# Altium project EXB200803.PrjPcb
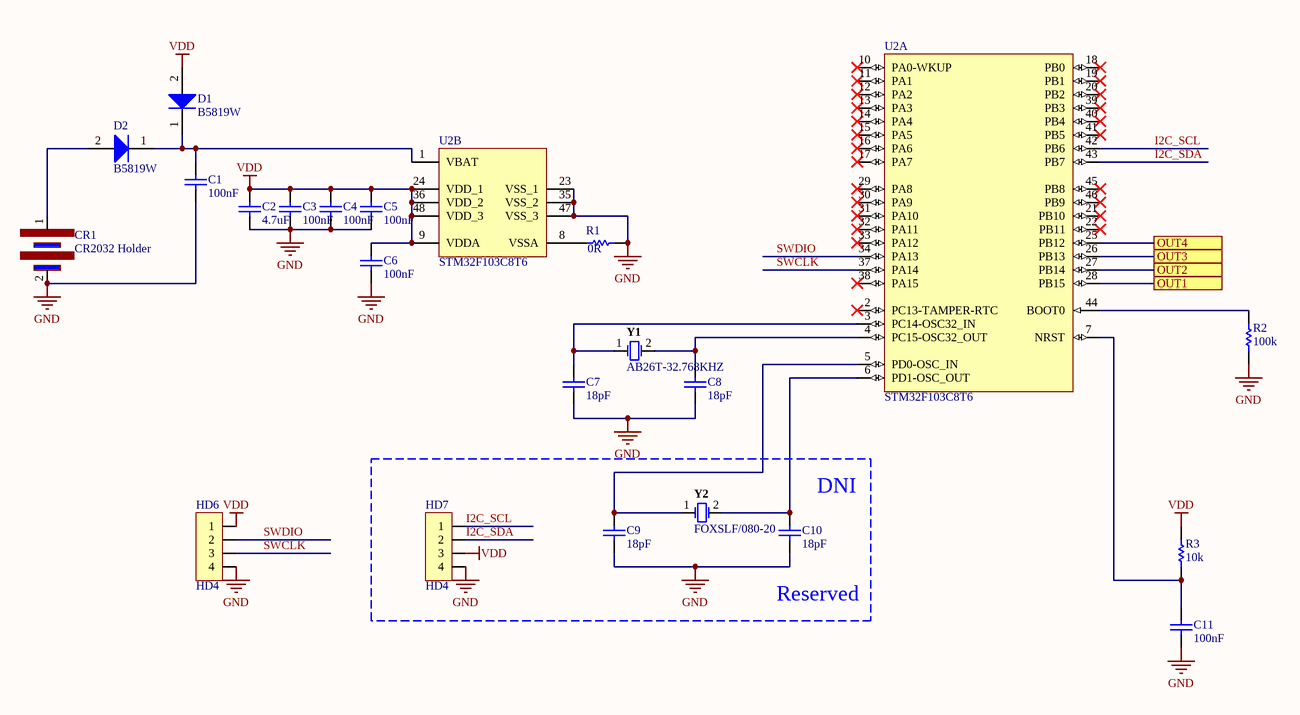
[diagram p0: 02. MCU.SchDoc]
4 sheets, 75 parts. Net scope: flat (ports and power ports of the same name join across sheets).
Board file: EXBELL200803.PcbDoc
Sheets:
  01. MAIN.SchDoc
  02. MCU.SchDoc
  03. OUTPUT.SchDoc
  04. POWER SUPPLY.SchDoc

## Sheet 01. MAIN.SchDoc
size A4; DocumentNumber: 1; SheetNumber: 1; SheetTotal: 4

### Notes on the sheet
- Title
- Size:
- Date:
- A4
- Number:
- Time:
- Revision:
- Sheet
- of
- N.S.T
- Design by:
- Check by:
- https://github.com/tung080827

## Sheet 02. MCU.SchDoc
size A4; DocumentNumber: 2; SheetNumber: 2; SheetTotal: 4

### Parts
C1  100nF  [0603 CAP]
C2  4.7uF  [0603 CAP]
C3  100nF  [0603 CAP]
C4  100nF  [0603 CAP]
C5  100nF  [0603 CAP]
C6  100nF  [0603 CAP]
C7  18pF  [0603 CAP]
C8  18pF  [0603 CAP]
C9  18pF  [0603 CAP]
C10  18pF  [0603 CAP]
C11  100nF  [0603 CAP]
CR1  CR2032 Holder  [CR2032]
D1  B5819W  [SOD123]
D2  B5819W  [SOD123]
HD6  HD4  [HD4x1 2.54mm]
HD7  HD4  [HD4x1 2.54mm]
R1  0R  [0603 RES]
R2  100k  [0603 RES]
R3  10k  [0603 RES]
U2  STM32F103C8T6  [STM-LQFP48]  (parts A,B of 2)
Y1  AB26T-32.768KHZ  [Crystal 3x8]
Y2  FOXSLF/080-20  [CRYSTAL HC49]

### Ports
OUT1, OUT2, OUT3, OUT4

### Nets
GND: C1.1 C2.1 C3.1 C4.1 C5.1 C6.1 C7.1 C8.1 C9.1 C10.1 C11.1 CR1.2(VSS) HD6.4 HD7.4 R1.2 R2.1 U2.23(VSS_1) U2.35(VSS_2) U2.47(VSS_3)
VDD: C2.2 C3.2 C4.2 C5.2 C6.2 D1.2(A) HD6.1 HD7.3 R3.2 U2.9(VDDA) U2.24(VDD_1) U2.36(VDD_2) U2.48(VDD_3)
I2C_SCL: HD7.1 U2.42(PB6)
I2C_SDA: HD7.2 U2.43(PB7)
SWCLK: HD6.3 U2.37(PA14)
SWDIO: HD6.2 U2.34(PA13)
NetC1_2: C1.2 D1.1(K) D2.1(K) U2.1(VBAT)
NetC7_2: C7.2 U2.3(PC14-OSC32_IN) Y1.1
NetC8_2: C8.2 U2.4(PC15-OSC32_OUT) Y1.2
NetC9_2: C9.2 U2.5(PD0-OSC_IN) Y2.1
NetC10_2: C10.2 U2.6(PD1-OSC_OUT) Y2.2
NetC11_2: C11.2 R3.1 U2.7(NRST)
NetCR1_1: CR1.1(VBAT) D2.2(A)
NetD7_1: U2.28(PB15) ; port OUT1
NetD8_1: U2.27(PB14) ; port OUT2
NetD9_1: U2.26(PB13) ; port OUT3
NetD10_1: U2.25(PB12) ; port OUT4
NetR1_1: R1.1 U2.8(VSSA)
NetR2_2: R2.2 U2.44(BOOT0)

Not connected (* = marked no-connect by the designer): U2 2(PC13-TAMPER-RTC)* 10(PA0-WKUP)* 11(PA1)* 12(PA2)* 13(PA3)* 14(PA4)* 15(PA5)* 16(PA6)* 17(PA7)* 18(PB0)* 19(PB1)* 20(PB2)* 21(PB10)* 22(PB11)* 29(PA8)* 30(PA9)* 31(PA10)* 32(PA11)* 33(PA12)* 38(PA15)* 39(PB3)* 40(PB4)* 41(PB5)* 45(PB8)* 46(PB9)*

### Notes on the sheet
- (near C10) DNI
- (near C10) Reserved
- Title
- Size:
- Date:
- A4
- Number:
- Time:
- Revision:
- Sheet
- of
- N.S.T
- Design by:
- Check by:
- https://github.com/tung080827

### Library data of the parts
C1 C3-C6 C11 = CMP-2100-03643-1: Chip Capacitor, 0.1 uF, +/- 10%, 50 V, -55 to 125 degC, 0603 (1608 Metric), RoHS, Tape and Reel; Manufacturer: Murata; Dielectric Material: Ceramic; Voltage Rating: 50V; Dielectric: X7R; Insulation Resistance: 10GR; Case Code (Metric): 1608; Lead Free: LeadFree; Depth: 0.8mm; Number of Pins: 2; Radiation Hardening: No; Case/Package: 0603; Manufacturer URL: http://www.murata.com/; Packaging: TapeandReel; Length: 1.6mm; Contact Plating: Tin; Datasheet URL: http://psearch.en.murata.com/capacitor/product/GRM188R71H104KA93%23.pdf; Tolerance: 10%; Case Code (Imperial): 0603; Min Operating Temperature: -55degC; RoHSCompliant: true; Capacitance: 100nF; Voltage: 50V; Termination: SMD/SMT; Mount: SurfaceMount; Material: Ceramic; Package Quantity: 1; Height: 0.8mm; Thickness: 0.035inch; REACH SVHC: NoSVHC; Max Operating Temperature: 125degC; Width: 0.8mm; Package Reference: 0603; Voltage Rating (DC): 50V; Datasheet Version: 42675.0; Package Description: 2-Pin Surface Mount Device, Body 1.6 x 0.8 mm
C2 = CMP-2100-03643-1: Chip Capacitor, 0.1 uF, +/- 10%, 50 V, -55 to 125 degC, 0603 (1608 Metric), RoHS, Tape and Reel; Manufacturer: Murata; Dielectric Material: Ceramic; Voltage Rating: 50V; Capacitance: 100nF; Dielectric: X7R; Insulation Resistance: 10GR; Case Code (Metric): 1608; Lead Free: LeadFree; Depth: 0.8mm; Number of Pins: 2; Radiation Hardening: No; Case/Package: 0603; Manufacturer URL: http://www.murata.com/; Packaging: TapeandReel; Length: 1.6mm; Contact Plating: Tin; Datasheet URL: http://psearch.en.murata.com/capacitor/product/GRM188R71H104KA93%23.pdf; Tolerance: 10%; Case Code (Imperial): 0603; Min Operating Temperature: -55degC; RoHSCompliant: true; Voltage: 50V; Termination: SMD/SMT; Mount: SurfaceMount; Material: Ceramic; Package Quantity: 1; Height: 0.8mm; Thickness: 0.035inch; REACH SVHC: NoSVHC; Max Operating Temperature: 125degC; Width: 0.8mm; Package Reference: 0603; Voltage Rating (DC): 50V; Datasheet Version: 42675.0; Package Description: 2-Pin Surface Mount Device, Body 1.6 x 0.8 mm
C7-C10 = CMP-2000-06099-1: Chip Capacitor, 18 pF, +/- 5%, 50 V, -55 to 125 degC, 0603 (1608 Metric), RoHS, Tape and Reel; Manufacturer: Samsung Electro-Mechanics; Rated Voltage: 50V; Dielectric: C0G; Manufacturer URL: http://www.samsungsem.com/global/index.jsp; Tolerance (%): ±5%; Package Description: 2-Pin Surface Mount Device, Body 1.60 x 0.80 mm; Datasheet URL: http://www.samsungsem.com/kr/support/product-search/mlcc/__icsFiles/afieldfile/2016/08/18/S_CL10C180JB8NNNC.pdf; Package Reference: 0603; Datasheet Version: 06/2016; Capacitance: 18pF; Mounting Technology: SurfaceMount; Case Size/Dimension: 0603
CR1 = CR2032
D1 D2 = CMP-1054-00068-1: Switching Diode, 2-Pin SOD-323, Pb-Free, Tape and Reel; Manufacturer: On Semiconductor; PartNumber: BAS16HT1G; Configuration: Single; IF Max (A): 0.2; trr Max (ns): 6; Packing: Tape and Reel; ComponentLink2URL: http://www.onsemi.com/pub_link/Collateral/BAS16HT1-D.PDF; ComponentLink3Description: Package Specification; RoHS: TRUE; PackageDescription: 2-Pin SOD, Body 1.7 x 1.25 mm; PackageReference: SOD-323-2-477-02; ComponentLink1URL: http://www.onsemi.com/; Mounting Technology: Surface Mount; ComponentLink1Description: Manufacturer URL; ComponentLink2Description: Datasheet; DatasheetVersion: Rev. 11; PackageVersion: Rev. H, 03/2007; ComponentLink3URL: http://www.onsemi.com/pub_link/Collateral/477-02.PDF.1
HD6 HD7 = HD4x1
R1-R3 = CMP-2000-03818-1: Manufacturer: Vishay Dale; Part Number: CRCW06030000Z0EB
U2 = CMP-0237-00215-3: ARM Cortex-M3 32-bit MCU, 64 KB Flash, 20 KB Internal RAM, 37 I/Os, 48-pin LQFP, -40 to 85 degC, Tray; Supply Voltage(Vcc) min (V): 2; Internal RAM Size (kB): 20; FLASH Size (Prog) (kB): 64; A/D Converter: 2x12-bit (10 Channel); I/Os (High Current): 37; Operating Frequency(F) (Processor speed) (MHz): 72; Core: ARM Cortex-M3; ComponentLink3Description: Package Specification; Mounting Technology: Surface Mount; PartNumber: STM32F103C8T6; PackageReference: LQFP48; Packing: Tray; ComponentLink3URL: http://www.st.com/st-web-ui/static/active/en/resource/technical/document/datasheet/DM00058181.pdf; DatasheetVersion: Rev. 16; ComponentLink1URL: http://www.st.com/web/en/home.html; PackageVersion: Rev. 6, 06/2013; ComponentLink2URL: http://www.st.com/st-web-ui/static/active/en/resource/technical/document/datasheet/CD00161566.pdf; ComponentLink1Description: Manufacturer URL; ComponentLink2Description: Datasheet; PackageDescription: 48-Pin Low Profile Quad Flat Package, 7 x 7 mm Body, 0.5 mm Pitch
Y1 = CMP-2000-05723-1: Crystal, 12.5 pF, 32.768 KHz, -10 to 60 degC, 2-Pin THD, RoHS, Bulk; Manufacturer: ABRACON; ESR: 35kOhms; Frequency Stability: -0.034PPM; Load Capacitance: 12.5pF; Tolerance: 20PPM; Case Length: 6.2mm; Case Diameter: 2.1mm; RoHS: Details; Product Category: Crystals; Type: WatchCrystal; Manufacturer URL: http://www.abracon.com/; Operating Temperature Range: -10Cto+60C; Package Description: 2-Pin Through Hole Device, Dia 2.1 mm, Body Length 6.2 mm; Termination Style: Radial; Datasheet Version: 06/2010; Datasheet URL: http://www.abracon.com/Resonators/AB26T.pdf; Packaging: Bulk; Factory Pack Quantity: 500; Brand: ABRACON; Mounting Technology: ThroughHole; Package URL: http://www.abracon.com/Support/PackageDrawing/Resonators/AB26T.PDF; Package / Case: Cylinder; Lead Spacing: 0.8mm; Dimensions: 2.1mmDia.x6.2mmL; Mounting Style: ThroughHole; Frequency: 32.768kHz; Package Reference: AB26T; Series: AB26T
Y2 = CMP-1749-00002-1: Resistance Weld Thru-Hole Crystal, 8 MHz, -20 to 70 degC, 2-Pin THD, RoHS, Bulk; Dropout Voltage: 2 V; Outputs: 1; Nominal Output Voltage: 5 V; Min Input Voltage: 7 V; Case\Package: TO-263-3; Max Input Voltage: 35 V; Max Ouput Current: 1 A; Length: 10.24 mm; Max Operating Temperature: 125 degC; Mount: Surface Mount; PackageDescription: 2-Pin Through Hole Device, Body 11.35 x 4.65 mm; Package Quantity: 50; Pins: 3; ComponentLink2URL: http://download.siliconexpert.com/pdfs/2015/4/5/6/5/7/200/fox_/manual/35607121449963728hc49slf.pdf; PackageReference: FOXSLF080-20; Min Operating Temperature: 0 degC; Height: 30.02 mm; Packaging: Rail/Tube; Radiation Hardening: No; Width: 9.35 mm; ComponentLink1URL: http://www.foxonline.com/; DatasheetVersion: Mar-15; ComponentLink1Description: Manufacturer URL; Output Voltage: 5 V; RoHSCompliant: true; REACH SVHC: No SVHC; Output Current: 1 A; ComponentLink2Description: Datasheet

## Sheet 03. OUTPUT.SchDoc
size A3; DocumentNumber: 4; SheetNumber: 4; SheetTotal: 4
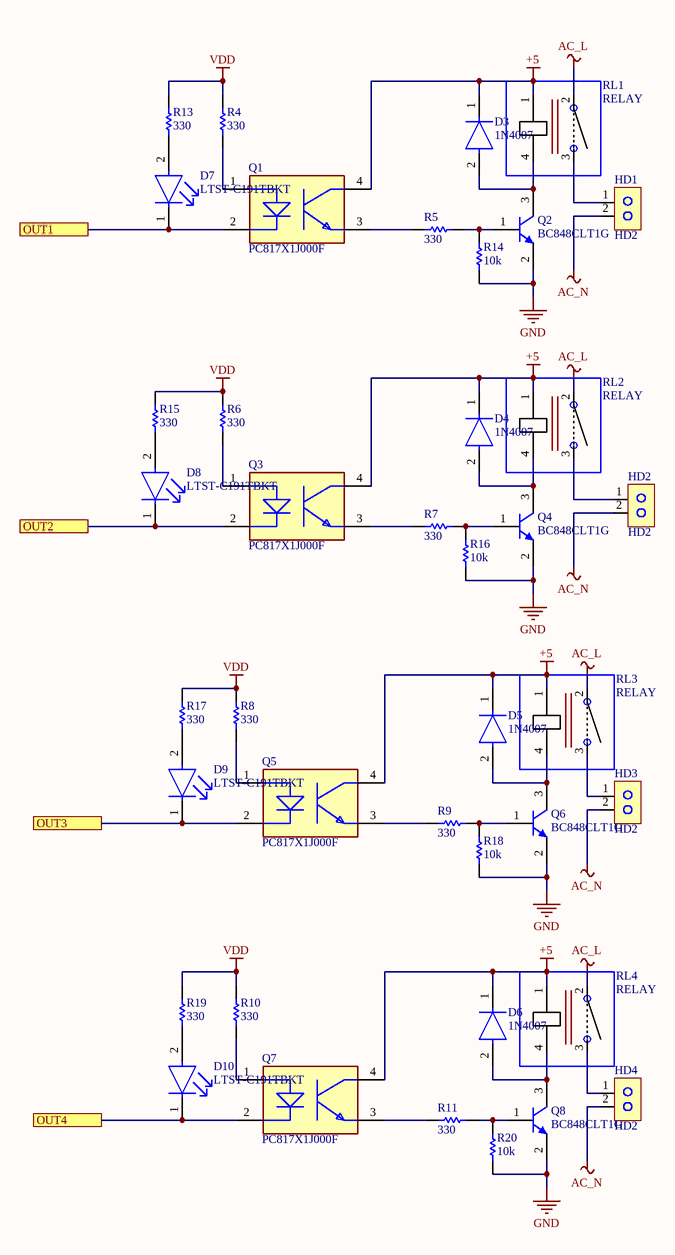
[diagram p1: 03. OUTPUT.SchDoc]

### Parts
D3  1N4007  [FP-SMA-MFG]
D4  1N4007  [FP-SMA-MFG]
D5  1N4007  [FP-SMA-MFG]
D6  1N4007  [FP-SMA-MFG]
D7  LTST-C191TBKT  [FP-LTST-C191TBKT-MFG]
D8  LTST-C191TBKT  [FP-LTST-C191TBKT-MFG]
D9  LTST-C191TBKT  [FP-LTST-C191TBKT-MFG]
D10  LTST-C191TBKT  [FP-LTST-C191TBKT-MFG]
HD1  HD2  [HD2 5.08mm]
HD2  HD2  [HD2 5.08mm]
HD3  HD2  [HD2 5.08mm]
HD4  HD2  [HD2 5.08mm]
Q1  PC817X1J000F  [FP-PC817X1J000F-MFG]
Q2  BC848CLT1G  [SOT23-3]
Q3  PC817X1J000F  [FP-PC817X1J000F-MFG]
Q4  BC848CLT1G  [SOT23-3]
Q5  PC817X1J000F  [FP-PC817X1J000F-MFG]
Q6  BC848CLT1G  [SOT23-3]
Q7  PC817X1J000F  [FP-PC817X1J000F-MFG]
Q8  BC848CLT1G  [SOT23-3]
R4  330  [0603 RES]
R5  330  [0603 RES]
R6  330  [0603 RES]
R7  330  [0603 RES]
R8  330  [0603 RES]
R9  330  [0603 RES]
R10  330  [0603 RES]
R11  330  [0603 RES]
R13  330  [0603 RES]
R14  10k  [0603 RES]
R15  330  [0603 RES]
R16  10k  [0603 RES]
R17  330  [0603 RES]
R18  10k  [0603 RES]
R19  330  [0603 RES]
R20  10k  [0603 RES]
RL1  RELAY  [RELAY G5NB OMRON]
RL2  RELAY  [RELAY G5NB OMRON]
RL3  RELAY  [RELAY G5NB OMRON]
RL4  RELAY  [RELAY G5NB OMRON]

### Ports
OUT1, OUT2, OUT3, OUT4

### Nets
+5: D3.1(C) D4.1(C) D5.1(C) D6.1(C) Q1.4(C) Q3.4(C) Q5.4(C) Q7.4(C) RL1.1 RL2.1 RL3.1 RL4.1
AC_L: RL1.2 RL2.2 RL3.2 RL4.2
AC_N: HD1.2 HD2.2 HD3.2 HD4.2
GND: Q2.2(E) Q4.2(E) Q6.2(E) Q8.2(E) R14.2 R16.2 R18.2 R20.2
VDD: R4.1 R6.1 R8.1 R10.1 R13.1 R15.1 R17.1 R19.1
NetD3_2: D3.2(A) Q2.3(C) RL1.4
NetD4_2: D4.2(A) Q4.3(C) RL2.4
NetD5_2: D5.2(A) Q6.3(C) RL3.4
NetD6_2: D6.2(A) Q8.3(C) RL4.4
NetD7_1: D7.1(C) Q1.2(C) ; port OUT1
NetD7_2: D7.2(A) R13.2
NetD8_1: D8.1(C) Q3.2(C) ; port OUT2
NetD8_2: D8.2(A) R15.2
NetD9_1: D9.1(C) Q5.2(C) ; port OUT3
NetD9_2: D9.2(A) R17.2
NetD10_1: D10.1(C) Q7.2(C) ; port OUT4
NetD10_2: D10.2(A) R19.2
NetHD1_1: HD1.1 RL1.3
NetHD2_1: HD2.1 RL2.3
NetHD3_1: HD3.1 RL3.3
NetHD4_1: HD4.1 RL4.3
NetQ1_1: Q1.1(A) R4.2
NetQ1_3: Q1.3(E) R5.2
NetQ2_1: Q2.1(B) R5.1 R14.1
NetQ3_1: Q3.1(A) R6.2
NetQ3_3: Q3.3(E) R7.2
NetQ4_1: Q4.1(B) R7.1 R16.1
NetQ5_1: Q5.1(A) R8.2
NetQ5_3: Q5.3(E) R9.2
NetQ6_1: Q6.1(B) R9.1 R18.1
NetQ7_1: Q7.1(A) R10.2
NetQ7_3: Q7.3(E) R11.2
NetQ8_1: Q8.1(B) R11.1 R20.1

### Notes on the sheet
- Title
- Size:
- Date:
- A4
- Number:
- Time:
- Revision:
- Sheet
- of
- N.S.T
- Design by:
- Check by:
- https://github.com/tung080827

### Library data of the parts
D3-D6 = CMP-12188-000002-1: DIODE GEN PURP 600V 1A SMA; Manufacturer: STMicroelectronics; Manufacturer Part Number: STTH1L06A; Standoff Height: 0.05mm; Max Surge Forward Current: 20A; Peak Reverse Current: 1uA; Max Junction Temp: +175°C; ComponentLink2URL: https://www.st.com/content/ccc/resource/technical/document/datasheet/e9/c2/09/e3/32/47/44/bd/CD00002694.pdf/files/CD00002694.pdf/jcr:content/translations/en.CD00002694.pdf; Temperature: to +175°C; Device Class L1: Discrete Semiconductors; Automotive: No; Digikey Description: DIODE GEN PURP 600V 1A SMA; Octopart: https://octopart.com/stth1l06a-stmicroelectronics-324385; Device Class L3: Rectifier Diodes; Max Repetitive Reverse Voltage: 600V; Lead Free: Yes; Forward Current: 1A; Package: SMA; ComponentLink2Description: Datasheet; Category: Diode; Mouser Description: DIODE GEN PURP 600V 1A SMA; RoHS: TRUE; Temperature Range High: +175°C; Height: 2.65mm; Device Class L2: Diodes
D7-D10 = CMP-22017-000008-1: LED BLUE CLEAR CHIP SMD; Lens Color: Colorless; Dominant Wavelength: 475nm; Forward Current: 20mA; Wavelength: 468nm; Viewing Angle: 130°; Power Dissipation: 76mW; Luminous Intensity: 180mcd; Reverse Voltage: 5V; Number of Elements: 1; Lens Style: Diffused; Forward Voltage: 3.8V; Max Power Dissipation: 75mW; Case Code (Metric): 1608; Packaging: Tape and Reel; Case/Package: 0603; Depth: 1.6mm; Mount: Surface Mount; Lead Free: Lead Free; Min Operating Temperature: -20°C; Lens Transparency: Clear; Illumination Color: Blue; Height: 0.55mm; Test Current: 20mA; Case Code (Imperial): 0603; Max Operating Temperature: 80°C; Number of Pins: 2; Length: 0.8mm; Radiation Hardening: No; Package Quantity: 1; Number of LEDs: 1; Width: 0.8mm; Color: Blue
Q1 Q3 Q5 Q7 = CMP-65434-000003-1: OPTOISOLATOR 5KV TRANS 4DIP; Collector Emitter Saturation Voltage: 200mV; Forward Voltage: 1.4V; Power Dissipation: 200mW; Input Current: 20mA; Max Collector Current: 50mA; Collector Emitter Breakdown Voltage: 80V; Rise Time: 18000ns; Number of Elements: 1; Reverse Breakdown Voltage: 6V; Current Transfer Ratio: 600%; Min Operating Temperature: -30°C; Number of Pins: 4; Radiation Hardening: No; Output Current per Channel: 50mA; Case/Package: DIP; Fall Time: 18000ns; Forward Current: 50mA; Isolation Voltage: 5kV; Package Quantity: 2000; Max Operating Temperature: 100°C; Packaging: Sleeve; Max Input Current: 50mA; Output Voltage: 80V; Max Power Dissipation: 200mW; Mount: Through Hole; Number of Channels: 1; Collector Emitter Voltage (VCEO): 80V
Q2 Q4 Q6 Q8 = CMP-1048-00721-1: General Purpose Transistor, NPN Silicon, 3-Pin SOT-23, Pb-Free, Tape and Reel; Manufacturer: On Semiconductor; fT Min (MHz): 100; IC Continuous (A): 0.1; Packing: Tape and Reel; ComponentLink1Description: Manufacturer URL; ComponentLink2URL: http://www.onsemi.cn/pub_link/Collateral/BC846ALT1-D.PDF; PartNumber: BC848CLT1G; PackageDescription: 3-Pin Small Outline Transistor, Body 2.92 x 1.3 mm, Pitch 0.95 mm; RoHS: TRUE; PackageReference: SOT-23-3-318-08; DatasheetVersion: Rev. 11; Mounting Technology: Surface Mount; PackageVersion: Rev. AP, 11/2009; ComponentLink3Description: Package Specification; ComponentLink1URL: http://www.onsemi.com/; ComponentLink2Description: Datasheet; Polarity: NPN; ComponentLink3URL: http://www.onsemi.cn/pub_link/Collateral/318-08.PDF
R4-R11 R13-R20 = CMP-2000-03818-1: as R1 on sheet 02. MCU
RL1-RL4 = RELAY 4PIN

## Sheet 04. POWER SUPPLY.SchDoc
size A4; DocumentNumber: 3; SheetNumber: 3; SheetTotal: 4
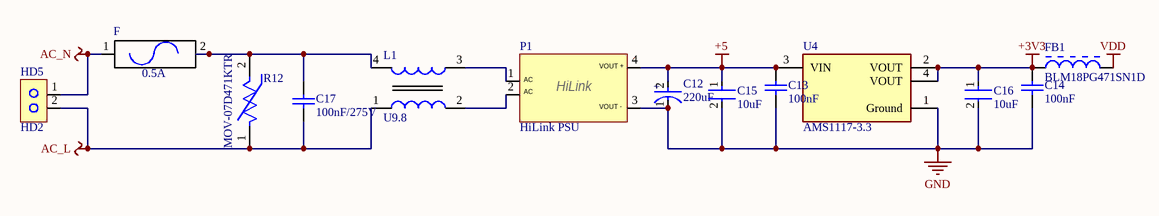
[diagram p2: 04. POWER SUPPLY.SchDoc]

### Parts
C12  220uF  [FP-ESTG4-MFG]
C13  100nF  [0603 CAP]
C14  100nF  [0603 CAP]
C15  10uF  [FP-CGA5L-0_3-0_1-IPC_B]
C16  10uF  [FP-CGA5L-0_3-0_1-IPC_B]
C17  100nF/275V  [CAP 12.5mm Pitch]
F  0.5A  [FUSE 20mm]
FB1  BLM18PG471SN1D  [0603 Ferrite]
HD5  HD2  [HD2 5.08mm]
L1  U9.8  [INDUCTOR FILTER U9.8]
P1  HiLink PSU  [HLK-5M05]
R12  MOV-07D471KTR  [FP-MOV-07D471KTR-MFG]
U4  AMS1117-3.3  [FP-AMS1117-IPC_C]

### Nets
+3V3: C14.2 C16.1 FB1.1 U4.2(VOUT) U4.4(VOUT)
+5: C12.2(A) C13.2 C15.1 P1.4 U4.3(VIN)
AC_L: C17.1 HD5.2 L1.1 R12.1
AC_N: F.1 HD5.1
GND: C12.1(C) C13.1 C14.1 C15.2 C16.2 P1.3 U4.1(Ground)
VDD: FB1.2
NetC17_2: C17.2 F.2 L1.4 R12.2
NetL1_2: L1.2 P1.2
NetL1_3: L1.3 P1.1

### Notes on the sheet
- Title
- Size:
- Date:
- A4
- Number:
- Time:
- Revision:
- Sheet
- of
- N.S.T
- Design by:
- Check by:
- https://github.com/tung080827
- (in symbol CMP-03015-000001-1) +
- (in symbol HiLink PSU) VOUT +; AC; HiLink; VOUT -

### Library data of the parts
C12 = CMP-03015-000001-1: CAP ALUM 220UF 20% 35V RADIAL; Manufacturer Part Number: EST227M035AG4AA; Manufacturer: Kemet; Leakage Current: 77uA; Life: 7000Hours; Ripple Current: 840mA; Dissipation Factor: 12%; Esr: 0.16Ω; Material: Aluminum; Value: 220uF; Category: Cap; Octopart: https://octopart.com/est227m035ag4aa-kemet-22264647; Device Class L3: Aluminum Electrolytic Capacitors; Mouser Description: Aluminum Electrolytic Capacitors - Leaded 35volts 220uF 20%; Digikey Description: CAP ALUM 220UF 20% 35V RADIAL; Lead Free: Yes; Device Class L2: Capacitors; Device Class L1: Passive Components; ComponentLink2URL: https://content.kemet.com/datasheets/KEM_A4010_EST.pdf; Voltage Rating: 35V; Temperature: -40°C to +105°C; Capacitance: 220uF; RoHS: TRUE; Temperature Range High: +105°C; Package: ESTG4; Temperature Range Low: -40°C; Height: 17mm; ComponentLink2Description: Datasheet; Automotive: No; Tolerance: 20%
C13 C14 = CMP-2100-03643-1: as C1 on sheet 02. MCU; Case Code (Metric): 1608; Lead Free: LeadFree; Depth: 0.8mm; Number of Pins: 2; Radiation Hardening: No; Case/Package: 0603; Manufacturer URL: http://www.murata.com/; Packaging: TapeandReel; Length: 1.6mm; Contact Plating: Tin; Datasheet URL: http://psearch.en.murata.com/capacitor/product/GRM188R71H104KA93%23.pdf; Tolerance: 10%; Case Code (Imperial): 0603; Min Operating Temperature: -55degC; RoHSCompliant: true; Capacitance: 100nF; Voltage: 50V; Termination: SMD/SMT; Mount: SurfaceMount; Material: Ceramic; Package Quantity: 1; Height: 0.8mm; Thickness: 0.035inch; REACH SVHC: NoSVHC; Max Operating Temperature: 125degC; Width: 0.8mm; Package Reference: 0603; Voltage Rating (DC): 50V; Datasheet Version: 42675.0; Package Description: 2-Pin Surface Mount Device, Body 1.6 x 0.8 mm
C15 C16 = CMP-08246-002126-1: Cap Ceramic 10uF 25V X7R 10% Pad SMD 1206 +125°C Automotive T/R; Case/Package: 1206; Thickness: 0.075inch; Ratings: AEC-Q200; Packaging: Tape and Reel; REACH SVHC: No SVHC; Composition: Ceramic; Tolerance: 10%; Capacitance: 10uF; Depth: 1.6mm; Lead Free: Lead Free; Termination: SMD/SMT; Package Quantity: 1; Dielectric: X7R; Length: 3.2mm; Min Operating Temperature: -55°C; Voltage Rating: 25V; Max Operating Temperature: 125°C; Mount: Surface Mount; Case Code (Metric): 3216; Height: 1.6mm; Weight: 0.000571oz; Width: 0.063inch; Voltage Rating (DC): 25V; Case Code (Imperial): 1206
C17 = CMP-2100-03643-1: Chip Capacitor, 0.1 uF, +/- 10%, 400 V, -55 to 125 degC, 0603 (1608 Metric), RoHS, Tape and Reel; Manufacturer: Murata; Dielectric Material: Ceramic; Voltage Rating: 50V; Capacitance: 100nF; Dielectric: X7R; Insulation Resistance: 10GR; Case Code (Metric): 1608; Lead Free: LeadFree; Depth: 0.8mm; Number of Pins: 2; Radiation Hardening: No; Case/Package: 0603; Manufacturer URL: http://www.murata.com/; Packaging: TapeandReel; Length: 1.6mm; Contact Plating: Tin; Datasheet URL: http://psearch.en.murata.com/capacitor/product/GRM188R71H104KA93%23.pdf; Tolerance: 10%; Case Code (Imperial): 0603; Min Operating Temperature: -55degC; RoHSCompliant: true; Voltage: 50V; Termination: SMD/SMT; Mount: SurfaceMount; Material: Ceramic; Package Quantity: 1; Height: 0.8mm; Thickness: 0.035inch; REACH SVHC: NoSVHC; Max Operating Temperature: 125degC; Width: 0.8mm; Package Reference: 0603; Voltage Rating (DC): 50V; Datasheet Version: 42675.0; Package Description: 2-Pin Surface Mount Device, Body 1.6 x 0.8 mm
F = FUSE
FB1 = CMP-0686-00587-2: Chip Ferrite Bead for Power Lines, 470 Ohm, 1000 mA, -55 to 125 degC, 1.6 x 0.8 x 0.95 mm SMD, Tape and Reel; Manufacturer: Murata; DC Resistance: 0.20 Ohm Max.; Rated Current: 1000 mA; Impedance (at 100 MHz): 470 Ohm +/- 25%; Mounting Technology: Surface Mount; ComponentLink3URL: http://www.murata.com/products/catalog/pdf/c31e.pdf; ComponentLink1URL: http://www.murata.com/; ComponentLink2URL: http://www.murata.com/products/catalog/pdf/c31e.pdf; ComponentLink3Description: Package Specification; PartNumber: BLM18PG471SN1D; ComponentLink1Description: Manufacturer URL; Packing: Tape and Reel; Operating Temperature Range: -55 to 125 degC; PackageReference: BLM18_H950-2; ComponentLink2Description: Datasheet; PackageDescription: 2-Pin Chip, Body 1.6 x 0.8 mm; DatasheetVersion: 08/2013
L1 = INDUCTOR FILTER
R12 = CMP-07402-000006-1: VARISTOR 470V 1.2KA DISC 7MM; Manufacturer: Bourns Inc.; Voltage Rating Ac: 300V; Varistor Voltage: 423V; Clamping Current: 10A; Voltage Rating Dc: 385V; Value: 126pF; Voltage Tolerance: 10%; Clamping Voltage: 775V; Package: 0; Octopart: https://octopart.com/mov-07d471ktr-bourns-19184728; Manufacturer Part Number: MOV-07D471KTR; Lead Free: Yes; RoHS: TRUE; Automotive: No; Device Class L2: Varistors; ComponentLink2URL: https://www.bourns.com/docs/product-datasheets/mov07d.pdf?sfvrsn=86ba81fd_26; Temperature Range Low: -40°C; Device Class L1: Circuit Protection; ComponentLink2Description: Datasheet; Device Class L3: unset; Temperature: -40°C to +105°C; Height: 11mm; Category: Res; Mouser Description: Varistors 105pF 470volts 10%; Temperature Range High: +105°C; Capacitance: 126pF; Digikey Description: VARISTOR 470V 1.2KA DISC 7MM
U4 = CMP-209535-000001-1: LDO Voltage Regulators 1A, 3.3V; Manufacturer: Advanced Monolithic Systems; Dropout Voltage: 1.1V; Output Type: Fixed; Nominal Supply Current: 5mA; Max Power Dissipation: 1.2W; Max Supply Voltage: 15V; Number Of Outputs: 1; Standoff Height: 0.64mm; Max Junction Temp: +125°C; Height: 1.8mm; Package: AMS1117; Device Class L2: Power Management ICs; ComponentLink2Description: Datasheet; ComponentLink2URL: http://www.advanced-monolithic.com/pdf/ds1117.pdf; Category: IC; RoHS: TRUE; Automotive: No; Device Class L1: Integrated Circuits (ICs); Output Current: 1A; Device Class L3: Voltage Regulators - Linear; Temperature: -40°C to +125°C; Output Voltage: 3.3V; Manufacturer Part Number: AMS1117-3.3; Temperature Range Low: -40°C; Octopart: https://octopart.com/ams1117-3.3-advanced+monolithic+systems-25899300; Lead Free: Yes; Ipc Land Pattern Name: SOT229P700X180-4; Temperature Range High: +125°C

## Nets that join several sheets
+5: 03. OUTPUT (12 pins), 04. POWER SUPPLY (5 pins)
AC_L: 03. OUTPUT (RL1.2 RL2.2 RL3.2 RL4.2), 04. POWER SUPPLY (C17.1 HD5.2 L1.1 R12.1)
AC_N: 03. OUTPUT (HD1.2 HD2.2 HD3.2 HD4.2), 04. POWER SUPPLY (F.1 HD5.1)
GND: 02. MCU (19 pins), 03. OUTPUT (8 pins), 04. POWER SUPPLY (7 pins)
VDD: 02. MCU (13 pins), 03. OUTPUT (8 pins), 04. POWER SUPPLY (FB1.2)
NetD7_1: 02. MCU (U2.28), 03. OUTPUT (D7.1 Q1.2)
NetD8_1: 02. MCU (U2.27), 03. OUTPUT (D8.1 Q3.2)
NetD9_1: 02. MCU (U2.26), 03. OUTPUT (D9.1 Q5.2)
NetD10_1: 02. MCU (U2.25), 03. OUTPUT (D10.1 Q7.2)